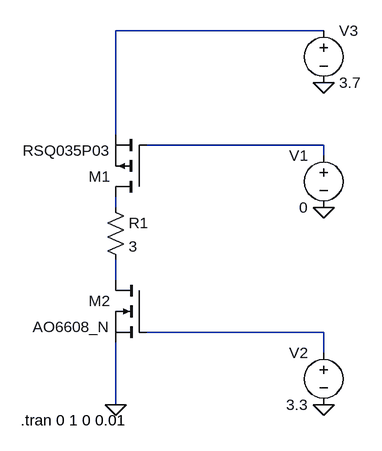
[diagram p0: schematic Ematch_Actuator.asc]
Ematch_Actuator.asc, the LTspice schematic file:
Version 4
SHEET 1 880 680
WIRE 240 -400 -80 -400
WIRE -80 -240 -80 -400
WIRE 240 -224 -32 -224
WIRE 240 -208 240 -224
WIRE -80 -128 -80 -144
WIRE -80 -16 -80 -48
WIRE 240 64 -32 64
WIRE 240 96 240 64
WIRE -80 176 -80 80
FLAG 240 -128 0
FLAG 240 176 0
FLAG -80 176 0
FLAG 240 -320 0
SYMBOL pmos -32 -144 R180
SYMATTR InstName M1
SYMATTR Value RSQ035P03
SYMBOL nmos -32 -16 M0
SYMATTR InstName M2
SYMATTR Value AO6608_N
SYMBOL voltage 240 -224 M0
WINDOW 123 0 0 Left 0
WINDOW 39 0 0 Left 0
SYMATTR InstName V1
SYMATTR Value 0
SYMBOL voltage 240 80 M0
WINDOW 123 0 0 Left 0
WINDOW 39 0 0 Left 0
SYMATTR InstName V2
SYMATTR Value 3.3
SYMBOL res -96 -144 R0
SYMATTR InstName R1
SYMATTR Value 3
SYMBOL voltage 240 -416 R0
WINDOW 123 0 0 Left 0
WINDOW 39 0 0 Left 0
SYMATTR InstName V3
SYMATTR Value 3.7
TEXT -226 200 Left 2 !.tran 0 1 0 0.01

The netlist it stands for:
* Ematch_Actuator.asc
M1 N003 N002 N001 N001 RSQ035P03
M2 N004 N005 0 0 AO6608_N
V1 N002 0 0
V2 N005 0 3.3
R1 N003 N004 3
V3 N001 0 3.7
.model NMOS NMOS
.model PMOS PMOS
.lib standard.mos
.tran 0 1 0 0.01
.backanno
.end